# EAGLE design mapleCUx_large_085 (EAGLE 7.3.0)
MAPLE-CUx Large Version
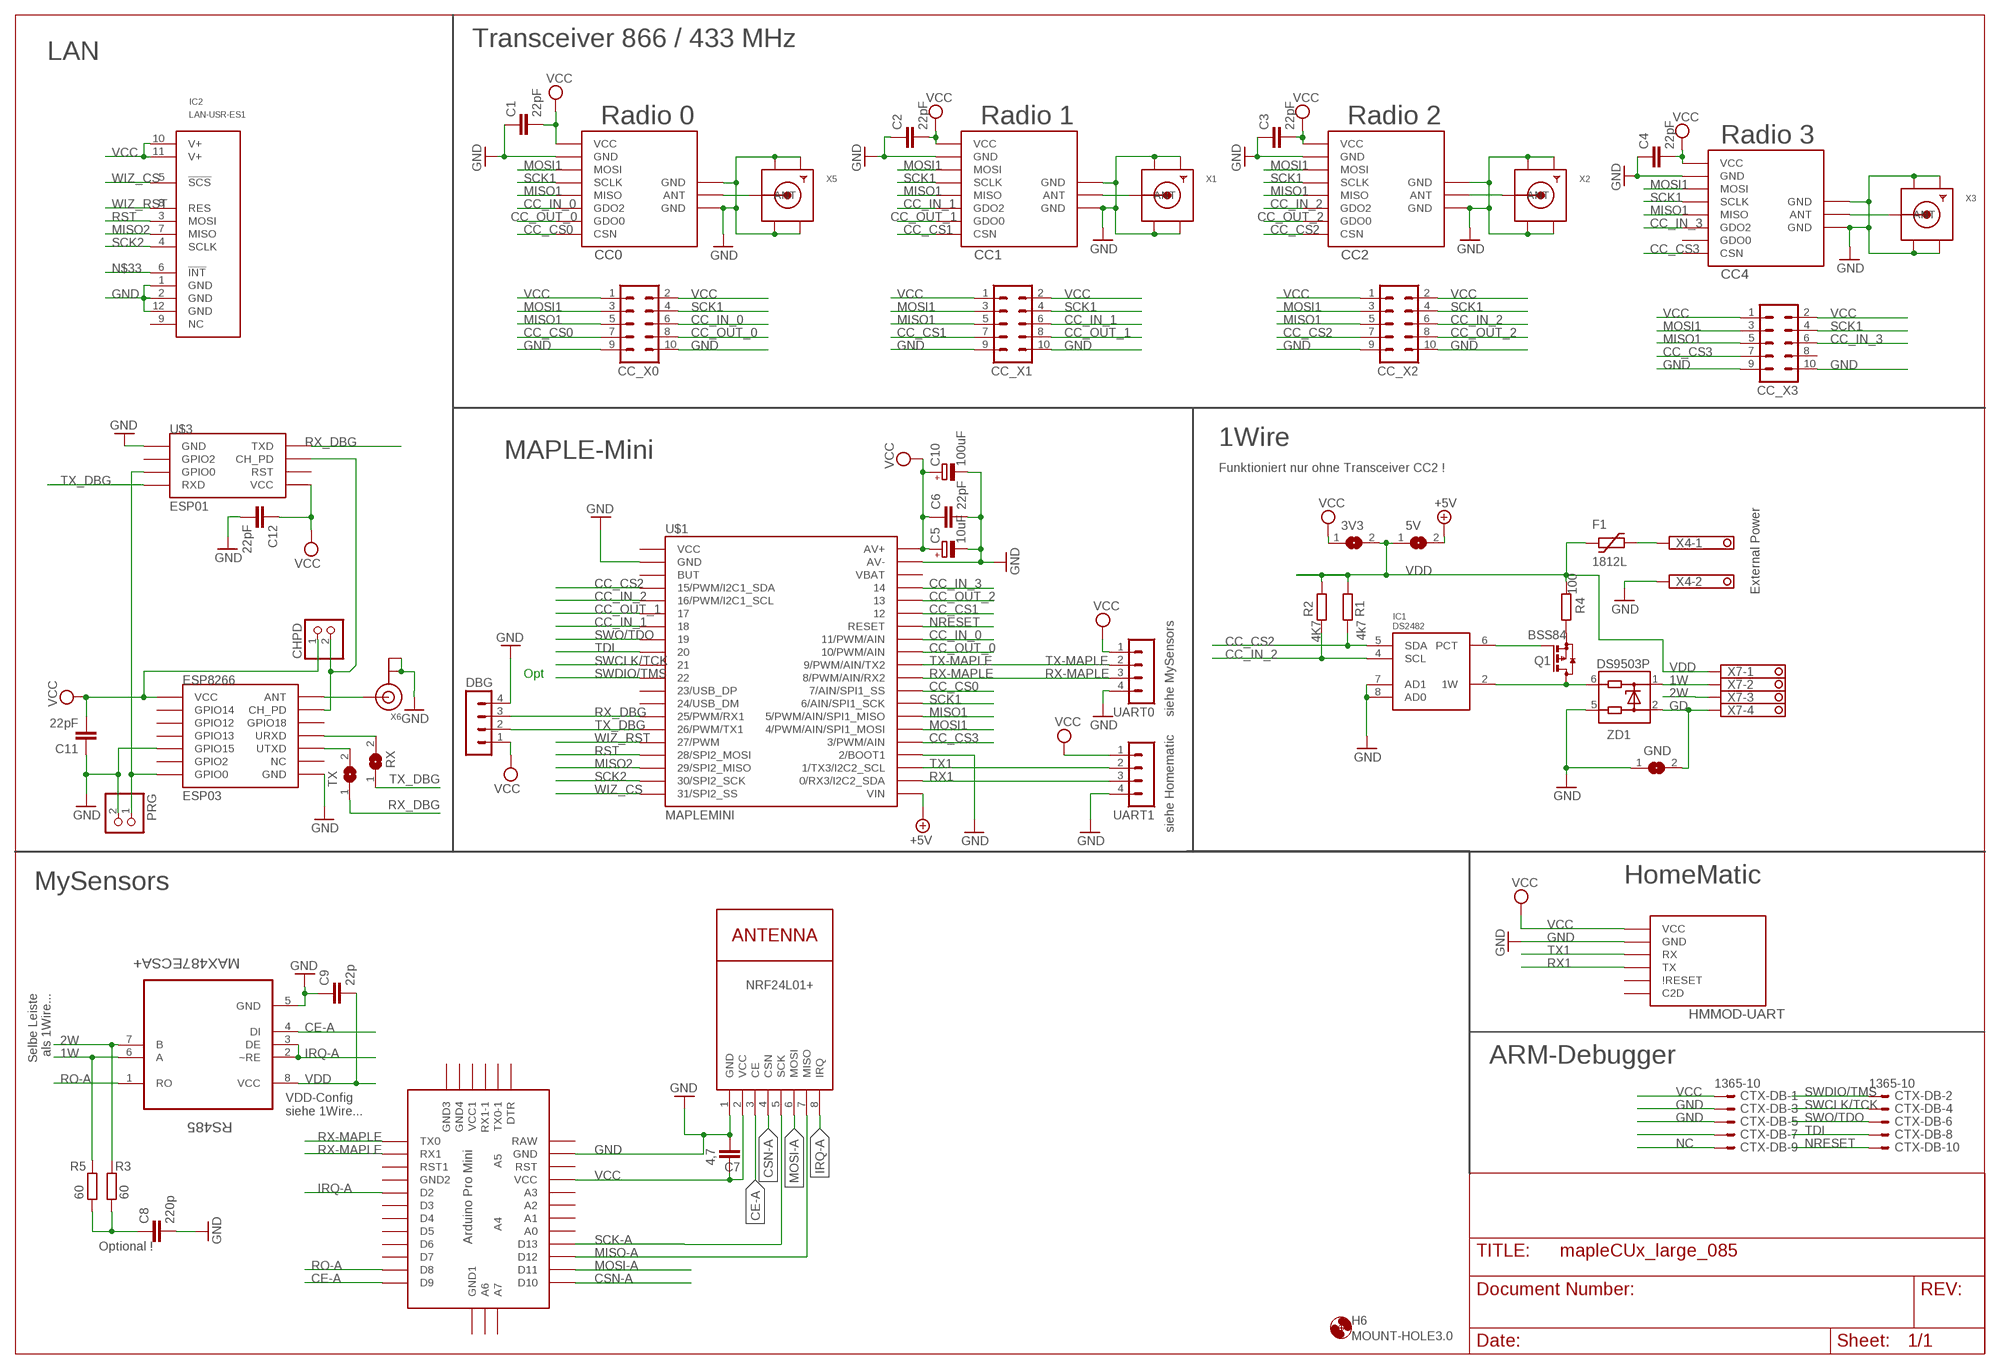
[diagram p0: schematic, sheet 1]

## Parts
3V3  SJ  [SJ]
5V  SJ  [SJ]
C1  22pF  C-EUC0805  [C0805]
C2  22pF  C-EUC0805  [C0805]
C3  22pF  C-EUC0805  [C0805]
C4  22pF  C-EUC0805  [C0805]
C5  10uF  CPOL-EUR/2012-12W  [R/2012-12W]
C6  22pF  C-EUC0805  [C0805]
C7  4,7  C-EUC1210  [C1210]
C8  220p  C-EUC0805  [C0805]
C9  22p  C-EUC0805  [C0805]
C10  100uF  CPOL-EUE5-8.5  [E5-8,5]
C11  22pF  C-EUC0805  [C0805]
C12  22pF  C-EUC0805  [C0805]
CC0  CC1101  CC1101_MODULE1SMD  [CC1101_MODULE1_SMD]
CC1  CC1101_MODULE1SMD  [CC1101_MODULE1_SMD]
CC2  CC1101_MODULE1SMD  [CC1101_MODULE1_SMD]
CC4  CC1101_MODULE1SMD  [CC1101_MODULE1_SMD]
CC_X0  MA05-2  [MA05-2]
CC_X1  MA05-2  [MA05-2]
CC_X2  MA05-2  [MA05-2]
CC_X3  MA05-2  [MA05-2]
CHPD  PINHD-1X2  [1X02]
CTX-DB  1365-10  [1365-10]
DBG  MA04-1  [MA04-1]
ESP8266  ESP03  [ESP03]
F1  1812L  [1812L]
GND  SJ  [SJ]
H6  MOUNT-HOLE3.0  [3,0]
HMMOD-UART  HM-MOD-UARTDIL  [HM-MOD-UART-DIL]
IC1  DS2482  DS2482-100S  [SO08]
IC2  LAN-USR-ES1  [USR-ES1]
NRF24L01+  NRF24L01+  WIRELESS-NRF24L01  [WIRELESS-NRF24L01]
PRG  PINHD-1X2  [1X02]
Q1  BSS84  [SOT23]
R1  4k7  R-EU_R0805  [R0805]
R2  4K7  R-EU_R0805  [R0805]
R3  60  R-EU_R0805  [R0805]
R4  100  R-EU_R0805  [R0805]
R5  60  R-EU_R0805  [R0805]
RS485  MAX487ECSA+  [SOIC127P600X175-8N]
RX  SJ  [SJ]
TX  SJ  [SJ]
U$1  MAPLEMINI  [20-DIP]
U$2  ABK-PRO-MINI  [ABK-PRO-MINI]
U$3  ESP01  [ESP01]
UART0  MA04-1  [MA04-1]
UART1  MA04-1  [MA04-1]
X1  SMACONNECTOR_EDGE_UFL  [SMA_EDGELAUNCH_UFL]
X2  SMACONNECTOR_EDGE_UFL  [SMA_EDGELAUNCH_UFL]
X3  SMACONNECTOR_EDGE_UFL  [SMA_EDGELAUNCH_UFL]
X4  1751248  [1751248]
X5  SMACONNECTOR_EDGE_UFL  [SMA_EDGELAUNCH_UFL]
X6  ANTENNA_U.FL  [U.FL]
X7  1751264  [1751264]
ZD1  DS9503P  [TSOC6]

## Nets
1W: R5.2 RS485.6(A) X7.2 ZD1.1
2W: R3.2 RS485.7(B) X7.3
+5V [PWR]: 5V.2 U$1.21(VIN)
CC_CS0: CC0.CSN CC_X0.7 U$1.29(7/AIN/SPI1_SS)
CC_CS1: CC1.CSN CC_X1.7 U$1.35
CC_CS2: CC2.CSN CC_X2.7 IC1.5(SDA) R1.2 U$1.4(15/PWM/I2C1_SDA)
CC_CS3: CC4.CSN CC_X3.7 U$1.25(3/PWM/AIN)
CC_IN_0: CC0.GDO2 CC_X0.6 U$1.33(11/PWM/AIN)
CC_IN_1: CC1.GDO2 CC_X1.6 U$1.7
CC_IN_2: CC2.GDO2 CC_X2.6 IC1.4(SCL) R2.2 U$1.5(16/PWM/I2C1_SCL)
CC_IN_3: CC4.GDO2 CC_X3.6 U$1.37
CC_OUT_0: CC0.GDO0 CC_X0.8 U$1.32(10/PWM/AIN)
CC_OUT_1: CC1.GDO0 CC_X1.8 U$1.6
CC_OUT_2: CC2.GDO0 CC_X2.8 U$1.36
CE-A: NRF24L01+.3(CE) RS485.4(DI) U$2.D9
CSN-A: NRF24L01+.4(CSN) U$2.D10
GD [PWR]: GND.2 X7.4 ZD1.2
GND [PWR]: C1.1 C2.1 C3.1 C4.1 C5.- C6.2 C7.1 C8.2 C9.1 C10.- C11.1 C12.2 CC0.GND@0(GND) CC0.GND@1(GND) CC0.GND@2(GND) CC1.GND@0(GND) CC1.GND@1(GND) CC1.GND@2(GND) CC2.GND@0(GND) CC2.GND@1(GND) CC2.GND@2(GND) CC4.GND@0(GND) CC4.GND@1(GND) CC4.GND@2(GND) CC_X0.9 CC_X0.10 CC_X1.9 CC_X1.10 CC_X2.9 CC_X2.10 CC_X3.9 CC_X3.10 CTX-DB.3 CTX-DB.5 DBG.4 ESP8266.GND ESP8266.GPIO15 GND.1 HMMOD-UART.2(GND) IC1.7(AD1) IC1.8(AD0) IC2.1(GND) IC2.2(GND) IC2.12(GND) NRF24L01+.1(GND) PRG.2 RS485.5(GND) U$1.2(GND) U$1.24(2/BOOT1) U$1.39(AV-) U$2.GND U$3.GND UART0.4 UART1.4 X1.GND@1(GND1) X1.GND@2(GND2) X1.GND@3(GND3) X1.GND@4(GND4) X2.GND@1(GND1) X2.GND@2(GND2) X2.GND@3(GND3) X2.GND@4(GND4) X3.GND@1(GND1) X3.GND@2(GND2) X3.GND@3(GND3) X3.GND@4(GND4) X4.2 X5.GND@1(GND1) X5.GND@2(GND2) X5.GND@3(GND3) X5.GND@4(GND4) X6.1(GND) X6.2(GND) ZD1.5
IRQ-A: NRF24L01+.8(IRQ) RS485.2(~RE) RS485.3(DE) U$2.D2
MISO1: CC0.MISO CC1.MISO CC2.MISO CC4.MISO CC_X0.5 CC_X1.5 CC_X2.5 CC_X3.5 U$1.27(5/PWM/AIN/SPI1_MISO)
MISO2: IC2.7(MISO) U$1.18(29/SPI2_MISO)
MISO-A: NRF24L01+.7(MISO) U$2.D12
MOSI1: CC0.MOSI CC1.MOSI CC2.MOSI CC4.MOSI CC_X0.3 CC_X1.3 CC_X2.3 CC_X3.3 U$1.26(4/PWM/AIN/SPI1_MOSI)
MOSI-A: NRF24L01+.6(MOSI) U$2.D11
N$1: CC1.ANT X1.P(ANT)
N$2: CC4.ANT X3.P(ANT)
N$3: CC2.ANT X2.P(ANT)
N$4: CC0.ANT X5.P(ANT)
N$8: CTX-DB.7
N$11: ESP8266.GPIO0 PRG.1 U$3.GPIO0
N$12: ESP8266.ANT X6.3(SIGNAL)
N$17: CHPD.2 ESP8266.CH_PD U$3.CH_PD
N$18: ESP8266.URXD RX.2
N$19: ESP8266.UTXD TX.2
N$21: C8.1 R3.1 R5.1
N$33: IC2.6(!INT!)
N$45 [PWR]: F1.P$2 X4.1
N$47: IC1.6(PCT) Q1.1(G)
N$48: IC1.2(1W) Q1.3(D) ZD1.6
N$52: Q1.2(S) R4.1
NC: CTX-DB.9
NRESET: CTX-DB.10 U$1.34(RESET)
RO-A: RS485.1(RO) U$2.D8
RST: IC2.3(MOSI) U$1.17(28/SPI2_MOSI)
RX1: HMMOD-UART.5(TX) U$1.22(0/RX3/I2C2_SDA) UART1.3
RX-MAPLE: U$1.30(8/PWM/AIN/RX2) U$2.RX1 U$2.TX0 UART0.3
RX_DBG: DBG.3 TX.1 U$1.14(25/PWM/RX1) U$3.TX(TXD)
SCK1: CC0.SCLK CC1.SCLK CC2.SCLK CC4.SCLK CC_X0.4 CC_X1.4 CC_X2.4 CC_X3.4 U$1.28(6/AIN/SPI1_SCK)
SCK2: IC2.4(SCLK) U$1.19(30/SPI2_SCK)
SCK-A: NRF24L01+.5(SCK) U$2.D13
SWCLK/TCK: CTX-DB.4 U$1.10
SWDIO/TMS: CTX-DB.2 U$1.11
SWO/TDO: CTX-DB.6 U$1.8
TDI: CTX-DB.8 U$1.9
TX1: HMMOD-UART.6(RX) U$1.23(1/TX3/I2C2_SCL) UART1.2
TX-MAPLE: U$1.31(9/PWM/AIN/TX2) UART0.2
TX_DBG: DBG.2 RX.1 U$1.15(26/PWM/TX1) U$3.RX(RXD)
VCC [PWR]: 3V3.1 C1.2 C2.2 C3.2 C4.2 C5.+ C6.1 C7.2 C10.+ C11.2 C12.1 CC0.VCC CC1.VCC CC2.VCC CC4.VCC CC_X0.1 CC_X0.2 CC_X1.1 CC_X1.2 CC_X2.1 CC_X2.2 CC_X3.1 CC_X3.2 CHPD.1 CTX-DB.1 DBG.1 ESP8266.VCC HMMOD-UART.1(VCC) IC2.10(V+) IC2.11(V+) NRF24L01+.2(VCC) U$1.40(AV+) U$2.VCC U$3.VCC UART0.1 UART1.1
VDD [PWR]: 3V3.2 5V.1 C9.2 F1.P$1 R1.1 R2.1 R4.2 RS485.8(VCC) X7.1
WIZ_CS: IC2.5(!SCS!) U$1.20(31/SPI2_SS)
WIZ_RST: IC2.8(RES) U$1.16(27/PWM)
Unconnected: CC4.GDO0 CC_X3.8 ESP8266.GPIO2 ESP8266.GPIO12 ESP8266.GPIO13 ESP8266.GPIO14 ESP8266.GPIO18 ESP8266.NC HMMOD-UART.3(C2D) HMMOD-UART.4(\!RESET) IC2.9(NC) U$1.1(VCC) U$1.3(BUT) U$1.12(23/USB_DP) U$1.13(24/USB_DM) U$1.38(VBAT) U$2.A0 U$2.A1 U$2.A2 U$2.A3 U$2.A4 U$2.A5 U$2.A6 U$2.A7 U$2.D3 U$2.D4 U$2.D5 U$2.D6 U$2.D7 U$2.DTR U$2.GND1(GND2) U$2.GND2(GND3) U$2.GND3(GND4) U$2.GND4(GND1) U$2.RAW U$2.RST U$2.RST1 U$2.RX1-1 U$2.TX0-1 U$2.VCC1 U$3.GPIO2 U$3.RST

## Notes on the sheet
- Transceiver 866 / 433 MHz
- LAN
- Radio 0 | Radio 1 | Radio 2
- Radio 3
- 1Wire
- MAPLE-Mini
- Funktioniert nur ohne Transceiver CC2 !
- External Power
- Opt
- siehe MySensors
- siehe Homematic
- MySensors | HomeMatic
- Selbe Leiste
  als 1Wire...
- ARM-Debugger
- VDD-Config
  siehe 1Wire...
- Optional !

## Power pins joined to a net without a drawn wire
GND: IC1.3(GND)
VDD: IC1.1(VDD)

## Library data of the parts
3V3 5V GND RX TX = jumper:SJ: SMD solder JUMPER
C1-C4 C6-C9 C11 C12 = rcl:C-EU: CAPACITOR, European symbol
C5 C10 = rcl:CPOL-EU: POLARIZED CAPACITOR, European symbol
CC0 CC1 CC2 CC4 = wireless:CC1101_MODULE1: CC1101 wireless module for 433/868 MHz (sold from Aliexpress). DIL version for mounting with pin header (and SMD soldering) and SMD only variant available.
CC_X0 CC_X1-CC_X3 = con-lstb:MA05-2: PIN HEADER; OC_FARNELL: unknown; OC_NEWARK: unknown
CHPD PRG = pinhead:PINHD-1X2: PIN HEADER
CTX-DB = con-leotronics:1365-10: DUAL ROW STRAIGHT HEADER 1364 SERIES. 1.27mm x 1.27mm. Without Fixing Post. SMT Source: http://www.leotronics.co.uk/Conexcon/Data%20Sheets/sec.%20A/1364ing.pdf; OC_FARNELL: unknown; OC_NEWARK: unknown
DBG UART0 UART1 = con-lstb:MA04-1: PIN HEADER; OC_FARNELL: unknown; OC_NEWARK: unknown
ESP8266 = esp8266modules:ESP03: ESP8266 Wifi module 03; DIMENSIONS: 17.3 x 12.1 mm; PINS: 14; PITCH: 0.078" / 2 mm
F1 = ptc-littlefuse:1812L
H6 = holes:MOUNT-HOLE: MOUNTING HOLE with drill center marker
HMMOD-UART = wireless:HM-MOD-UART: eQ3 HM-MOD-UART-AW-SH2 wireless module for 868 MHz. DIL version for mounting with pin header (antenna upwards) and SMD variant available (antenna downwards).
IC1 = 1wire:DS2482-100: I2C to 1-Wire Host Adapter/Line Driver This device is a onewire host and I2C interface in one chip. It provides the complete DC/AC requirements for onewire communication, including overdrive speed mode, but, unlike the DS2480B chip, no 12V EPROM programming. Notes: For overdrive speed and 5V EEPROM programming, an external active pullup circuit must be connected to the 1W, VDD and PCT pin. See the datasheet for details. The lower two I2C adress bits of the chip can be selected by external pins, so up to 4 chips may be connected to the same I2C bus. Author: Orginal device and description from Giovanni Varasano <giovanni.varasano@fastwebnet.it> Improved by Jan Kandziora <jjj@gmx.de>
IC2 = Martin-Communication:LAN-USR-ES1
NRF24L01+ = diy-modules:WIRELESS-NRF24L01: 2.4 GHz Wireless Module based on NRF24L01 chip
Q1 = transistor-small-signal:BSS84: P-CHANNEL MOS FET
R1-R5 = rcl:R-EU_: RESISTOR, European symbol
RS485 = Maxim_By_element14_Batch_1:MAX487ECSA+: Low-Power, Slew-Rate-Limited RS-485/RS-422 Transceivers; MPN: MAX487ECSA+; OC_FARNELL: 9724532; OC_NEWARK: 68K4803; PACKAGE: SOIC-8; SUPPLIER: Maxim
U$1 = maplemini-small:MAPLEMINI
U$2 = Arduino-clone:ABK-PRO-MINI: ABK Pro-Mini Arduino Clone
U$3 = esp8266modules:ESP01: ESP8266 Wifi module 01
X1-X3 X5 = adafruit:SMACONNECTOR: SMA Connector 90° DIP SMA Connector, 50 Ohm (4UConnector: 07259)
X4 = con-phoenix-350:1751248: MKDS 1/ 2-3,5 Printklemme Nennstrom: 10 A Bemessungsspannung: 160 V Raster: 3,5 mm Polzahl: 2 Montageart: Löten Anschlussart: Schraubanschluss Anschlussrichtung vom Leiter zur Platine: 0° Source: http://eshop.phoenixcontact.com .. 1751248.pdf; OC_FARNELL: unknown; OC_NEWARK: unknown
X6 = adafruit:ANTENNA_U.FL: U.FL Antenna Connector
X7 = con-phoenix-350:1751264: MKDS 1/ 4-3,5 Printklemme Nennstrom: 10 A Bemessungsspannung: 160 V Raster: 3,5 mm Polzahl: 4 Montageart: Löten Anschlussart: Schraubanschluss Anschlussrichtung vom Leiter zur Platine: 0° Source: http://eshop.phoenixcontact.com .. 1751264.pdf; MPN: 1751264; OC_FARNELL: unknown; OC_NEWARK: 10R0934
ZD1 = 1wire:DS9503: ESD Protection Diode with Resistors This ESD protection diode is designed especially for onewire host interfaces. Unlike the DS9502, it has two additional 5Ohm resitors in the 1W and GND line. Pin 5 and 6 have to be connected to the host side, pin 1 und 2 to the network side. The 1W line is through pin 1 and 6, the GND line is through pin 2 and 5. Author: Jan Kandziora <jjj@gmx.de>

## Net classes
0 default: width 0.305 mm
1 PWR: width 0.457 mm

## Board
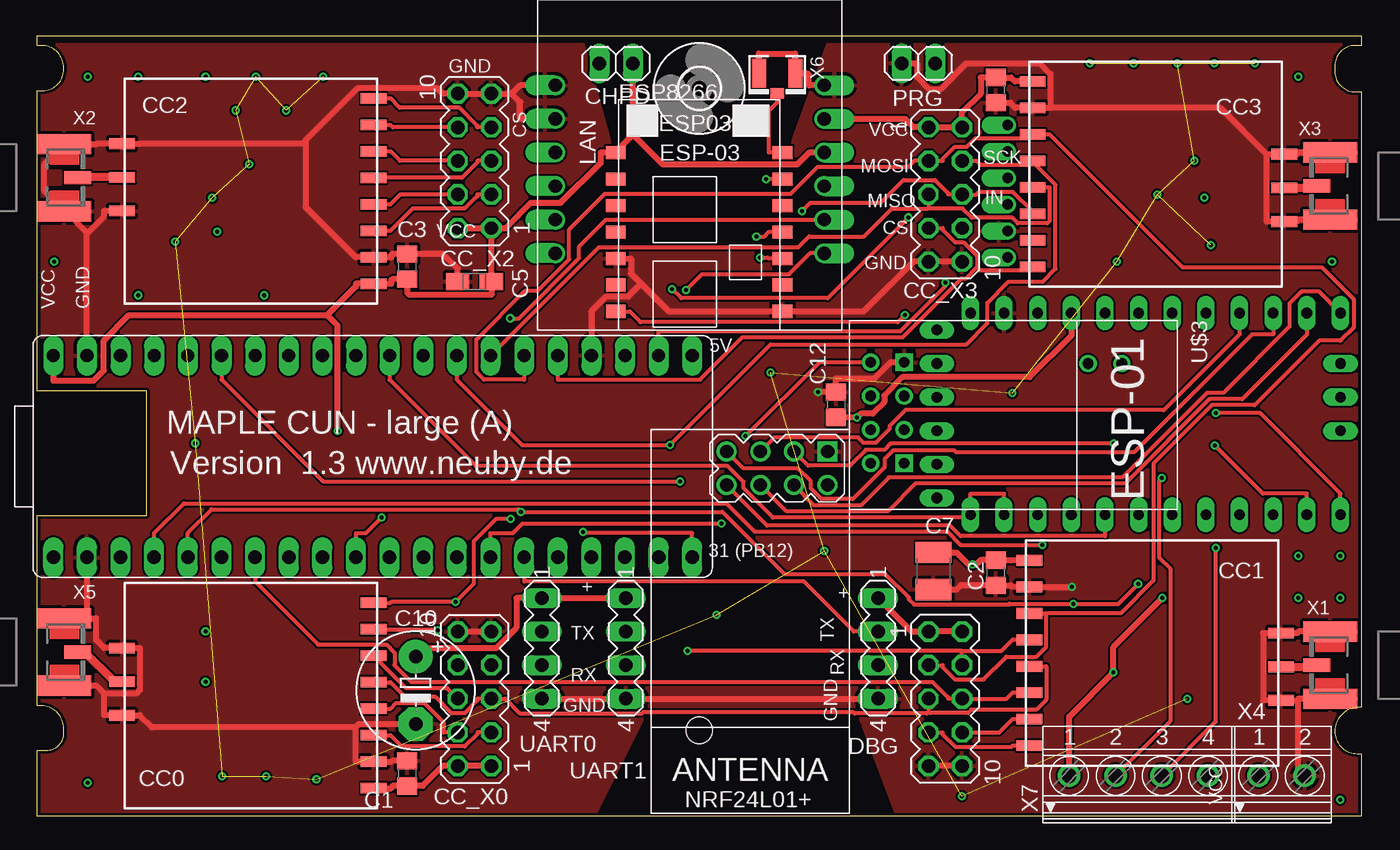
[diagram p1: board, top side]
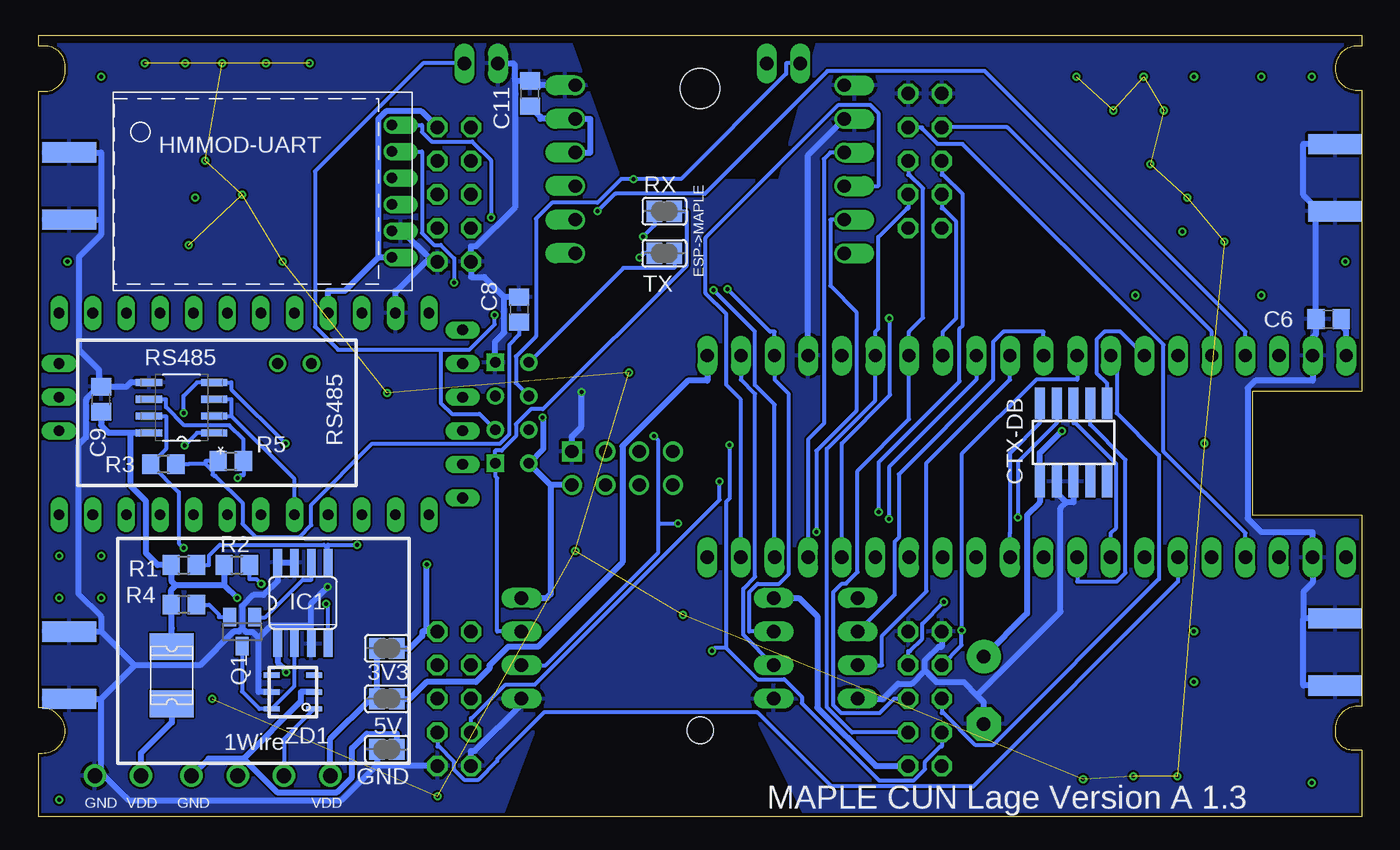
[diagram p2: board, bottom side, seen from below]

Size 100 x 59 mm. Coordinates in mm from the lower left corner, seen from the top.
Outline: 0,0 0,5 0.71,5 arc90 2,6.29 2,6.67 arc90 0.32,8.35 0,8.35 0,22.73 8.26,22.73 8.26,32.13 0,32.13 0,54.83 0.39,54.83 arc90 2,56.44 2,56.57 arc90 0.33,58.24 0,58.24 0,59 100,59 100,58.24 99.54,58.24 arc90 98,56.7 98,56.41 arc90 99.41,54.75 100,54.75 100,8.24 99.8,8.24 arc90 98,6.44 arc90 99.69,4.75 100,4.75 100,0 0,0
Copper layers (1*16): Top 0.035mm / dielectric 1.5mm / Bottom 0.035mm
Design rules "SeeedStudio_2layer_DRU_no_angle_20140221": minimum track width 6mil, minimum drill 12mil, track to track 6mil, track to pad 6mil, pad to pad 6mil, via to via 6mil, smd to smd 0mil, copper to edge 10mil, drill to drill 10mil, minimum pad ring 10mil, minimum via ring 6mil, stop-mask expansion 2mil, vias tented up to drill 100mil, thermal gap 10mil
Holes 2 mm at 50,6.5
tRestrict: area 0,58.6 to 100,59; area 45.7,0 to 62.2,7
bRestrict: area 0,58.6 to 100,59; area 0,58.6 to 100,59; area 45.7,0 to 62.2,7

### Footprints (pad centres in the part's own frame; a part is rotated, then mirrored left to right if it is on the bottom)
SJ = smd 1.168 x 1.6: 1 -0.762,0; 2 0.762,0
C0805 = smd 1.3 x 1.5: 1 -0.95,0; 2 0.95,0
R/2012-12W = smd 1.75 x 1.26: + 1.275,0; - -1.275,0
C1210 = smd 1.6 x 2.7: 1 -1.4,0; 2 1.4,0
E5-8,5 = drill 1.016 pad 2.54: + -2.54,0 | drill 1.016 pad 2.54 octagon: - 2.54,0
CC1101_MODULE1_SMD = smd 1.93 x 0.813: ANT 19,5.96; CSN 0,0; GDO0 0,2; GDO2 0,4; GND@0 0,12; GND@1 19,8.5; GND@2 19,3.42; MISO 0,6; MOSI 0,10; SCLK 0,8; VCC 0,14
MA05-2 = drill 1.016 octagon: 1 -5.08,-1.27; 2 -5.08,1.27; 3 -2.54,-1.27; 4 -2.54,1.27; 5 0,-1.27; 6 0,1.27; 7 2.54,-1.27; 8 2.54,1.27; 9 5.08,-1.27; 10 5.08,1.27
1X02 = drill 1.016 long: 1 -1.27,0; 2 1.27,0
1365-10 = smd 0.76 x 2.4: 1 -2.54,-2.95; 2 -2.54,2.95; 3 -1.27,-2.95; 4 -1.27,2.95; 5 0,-2.95; 6 0,2.95; 7 1.27,-2.95; 8 1.27,2.95; 9 2.54,-2.95; 10 2.54,2.95
MA04-1 = drill 1.016 long: 1 -3.81,0; 2 -1.27,0; 3 1.27,0; 4 3.81,0
ESP03 = smd 1.5 x 1: ANT 7.4,4.8; CH_PD 7.4,2.8; GND 7.4,-7.2; GPIO0 -5.2,-7.2; GPIO2 -5.2,-5.2; GPIO12 -5.2,0.8; GPIO13 -5.2,-1.2; GPIO14 -5.2,2.8; GPIO15 -5.2,-3.2; GPIO18 7.4,0.8; NC 7.4,-5.2; URXD 7.4,-1.2; UTXD 7.4,-3.2; VCC -5.2,4.8
1812L = smd 2.03 x 3.3: P$1 -2.16,0; P$2 2.16,0
3,0 = hole 3: 0,0
HM-MOD-UART-DIL = drill 0.8 offset: 1 0,12; 2 0,10; 3 0,8; 4 0,6; 5 0,4; 6 0,2
SO08 = smd 0.66 x 2.032: 1 -1.905,-3.073; 2 -0.635,-3.073; 3 0.635,-3.073; 4 1.905,-3.073; 5 1.905,3.073; 6 0.635,3.073; 7 -0.635,3.073; 8 -1.905,3.073
USR-ES1 = drill 1 pad 1.35 offset: 1 -10.16,5.715; 2 -10.16,3.175; 3 -10.16,0.635; 4 -10.16,-1.905; 5 -10.16,-4.445; 6 -10.16,-6.985; 7 10.16,-6.985; 8 10.16,-4.445; 9 10.16,-1.905; 10 10.16,0.635; 11 10.16,3.175; 12 10.16,5.715
WIRELESS-NRF24L01 = drill 1 square: 1 -12.7,6.35 | drill 1: 2 -10.16,6.35; 3 -12.7,3.81; 4 -10.16,3.81; 5 -12.7,1.27; 6 -10.16,1.27; 7 -12.7,-1.27; 8 -10.16,-1.27
SOT23 = smd 1 x 1.4: 1 -0.95,-1.1; 2 0.95,-1.1; 3 0,1.1
R0805 = smd 1.3 x 1.5: 1 -0.95,0; 2 0.95,0
SOIC127P600X175-8N = smd 1.981 x 0.533: 1 -2.464,1.905; 2 -2.464,0.635; 3 -2.464,-0.635; 4 -2.464,-1.905; 5 2.464,-1.905; 6 2.464,-0.635; 7 2.464,0.635; 8 2.464,1.905
20-DIP = drill 1.016 pad 1.27 long: 1 -24.13,-7.62; 2 -21.59,-7.62; 3 -19.05,-7.62; 4 -16.51,-7.62; 5 -13.97,-7.62; 6 -11.43,-7.62; 7 -8.89,-7.62; 8 -6.35,-7.62; 9 -3.81,-7.62; 10 -1.27,-7.62; 11 1.27,-7.62; 12 3.81,-7.62; 13 6.35,-7.62; 14 8.89,-7.62; 15 11.43,-7.62; 16 13.97,-7.62; 17 16.51,-7.62; 18 19.05,-7.62; 19 21.59,-7.62; 20 24.13,-7.62 | drill 1 pad 1.27 long: 21 24.13,7.62; 22 21.59,7.62; 23 19.05,7.62; 24 16.51,7.62; 25 13.97,7.62; 26 11.43,7.62; 27 8.89,7.62; 28 6.35,7.62; 29 3.81,7.62; 30 1.27,7.62; 31 -1.27,7.62; 32 -3.81,7.62; 33 -6.35,7.62; 34 -8.89,7.62; 35 -11.43,7.62; 36 -13.97,7.62; 37 -16.51,7.62; 38 -19.05,7.62; 39 -21.59,7.62; 40 -24.13,7.62
ABK-PRO-MINI = drill 0.8 long: A0 10.16,-3.81; A1 10.16,-6.35; A2 10.16,-8.89; A3 10.16,-11.43; A6 3.81,-21.59; A7 6.35,-21.59; D2 -5.08,-3.81; D3 -5.08,-6.35; D4 -5.08,-8.89; D5 -5.08,-11.43; D6 -5.08,-13.97; D7 -5.08,-16.51; D8 -5.08,-19.05; D9 -5.08,-21.59; D10 10.16,-21.59; D11 10.16,-19.05; D12 10.16,-16.51; D13 10.16,-13.97; DTR 8.89,8.89; GND 10.16,3.81; GND1 -5.08,-1.27; GND2 -3.81,8.89; GND3 -1.27,8.89; GND4 1.27,-21.59; RAW 10.16,6.35; RST 10.16,1.27; RST1 -5.08,1.27; RX1 -5.08,3.81; RX1-1 3.81,8.89; TX0 -5.08,6.35; TX0-1 6.35,8.89; VCC 10.16,-1.27; VCC1 1.27,8.89 | drill 0.8: A4 6.35,-5.08; A5 6.35,-2.54
ESP01 = drill 0.8: CH_PD -1.285,-8.178; GPIO0 1.255,-5.638; GPIO2 -1.285,-5.638; RST 1.255,-8.178; TX -3.825,-8.178; VCC 3.795,-8.178 | drill 0.8 square: GND -3.825,-5.638; RX 3.795,-5.638
SMA_EDGELAUNCH_UFL = smd 4.064 x 1.524: GND@1 2.032,-2.54; GND@2 2.032,2.54 | smd 4.064 x 1.524 bottom: GND@3 2.032,2.54; GND@4 2.032,-2.54 | smd 2.032 x 1.016: P 3.048,0
1751248 = drill 1.1 pad 1.7: 1 -1.75,-0.1; 2 1.75,-0.1
U.FL = smd 2.2 x 1.05: 1 0,1.375; 2 0,-1.375 | smd 0.8 x 1: 3 1.525,0
1751264 = drill 1.1 pad 1.7: 1 -5.25,-0.1; 2 -1.75,-0.1; 3 1.75,-0.1; 4 5.25,-0.1
TSOC6 = smd 0.406 x 1.219: 1 -1.27,-1.6; 2 0,-1.6; 3 1.27,-1.6; 4 1.27,1.6; 5 0,1.6; 6 -1.27,1.6

### Placement (x,y rotation side)
3V3  73.66,12.7 180 bottom
5V  73.66,8.89 0 bottom
C1  27.94,3.25 270 top
C2  72.39,18.41 90 top
C3  27.94,41.55 270 top
C4  72.39,54.88 90 top
C5  33.02,40.4 0 top
C6  2.54,37.58 180 bottom
C7  67.69,18.54 90 top
C8  63.67,38.3 90 bottom
C9  95.25,31.52 270 bottom
C10  28.57,9.53 270 top
C11  62.87,54.61 270 bottom
C12  60.33,31.11 90 top
CC0  25.4,16.14 180 top
CC1  74.93,5.35 0 top
CC2  25.4,54.24 180 top
CC4  75.18,41.53 0 top
CC_X0  33.02,8.89 90 top
CC_X1  68.58,8.89 270 top
CC_X2  33.02,49.53 90 top
CC_X3  68.58,46.99 270 top
CHPD  43.72,56.9 180 top
CTX-DB  21.81,28.26 0 bottom
DBG  63.5,12.7 270 top
ESP8266  48.9,45.35 0 top
F1  89.92,10.67 270 bottom
GND  73.66,5.08 0 bottom
H6  50,55 0 top
HMMOD-UART  73.28,54.23 180 bottom
IC1  80.01,16.13 0 bottom
IC2  49.28,49.53 0 top
NRF24L01+  53.34,14.88 270 top
PRG  66.55,56.9 180 top
Q1  84.6,13.95 180 bottom
R1  89,19 0 bottom
R2  85,19 0 bottom
R3  90.55,26.61 180 bottom
R4  89,16 180 bottom
R5  85.45,26.84 0 bottom
RS485  89.17,30.89 180 bottom
RX  52.7,45.72 180 bottom
TX  52.7,42.55 180 bottom
U$1  25.34,27.19 0 top
U$2  76.83,27.87 90 top
U$3  71.12,30.48 270 top
UART0  38.1,12.7 270 top
UART1  44.45,12.7 270 top
X1  99.69,11.43 180 top
X2  0,48.26 0 top
X3  99.69,47.62 180 top
X4  93.98,3.17 0 top
X5  0,12.43 0 top
X6  55.88,56.15 270 top
X7  83.19,3.17 0 top
ZD1  80.77,9.4 90 bottom

### Tracks (layer width: path | path; a pad name or v marks a point on that pad's centre or on a via)
1W  (via drill 0.3 pad 0.61)
  Top 0.305: X7.2 85.6,7.24 85.6,18.69 84.77,19.52 84.77,25.4 v84.93,25.57
  Bottom 0.305: RS485.6 90.34,31.52 90.34,30.92 88.97,29.55 85.56,29.55 84.5,28.49 R5.2 84.5,25.79 84.71,25.79 v84.93,25.57 | ZD1.1 81.44,5.87 X7.2
2W  (via drill 0.3 pad 0.61)
  Top 0.305: X7.3 89.03,7.17 v89.03,20.29
  Bottom 0.305: v89.03,20.29 89.37,20.63 89.37,24.49 R3.2 90.34,27.78 90.34,30.25 RS485.7
+5V
  Bottom 0.457: 5V.2 71.93,8.89 70.66,10.16 66.93,10.16 65.91,11.18 65.91,11.41 64.5,12.83 62.26,12.83 55.88,19.21 55.88,27.97 50.93,32.92 49.47,32.92 U$1.21
CC_CS0  (via drill 0.3 pad 0.61)
  Top 0.305: CC0.CSN 26.67,16.14 26.72,16.2 v31.58,16.2 32.96,17.57 32.96,20.79 34.63,22.47 v35.75,22.47
  Bottom 0.305: v35.75,22.47 35.75,26.4 29.15,33 U$1.29 | CC_X0.7 34.29,12.5 34.16,12.5 33.22,13.43 33.22,14.55 v31.58,16.2
CC_CS1  (via drill 0.3 pad 0.61)
  Top 0.305: CC1.CSN 73.66,5.35 73.55,5.24 69.35,5.24 68.38,6.22 68.38,6.35 CC_X1.7 | U$1.35 13.91,33 21.6,25.31 v48.54,25.31
  Bottom 0.305: CC_X1.7 67.31,7.42 67.25,7.42 64.69,9.98 62.47,9.98 48.54,23.91 v48.54,25.31
CC_CS2  (via drill 0.3 pad 0.61)
  Top 0.305: U$1.4 8.83,21.4 11.09,23.66 52.05,23.66 54.19,21.52 68.73,21.52 69.74,20.52 v75.91,20.52 | CC2.CSN 26.67,54.24 27.38,53.53 31.89,53.53 33.22,52.2 33.22,52.07 CC_X2.7
  Bottom 0.305: R1.2 87.09,19 87.09,19.72 86.29,20.52 78.42,20.52 78.11,20.21 | 78.11,20.21 78.11,20.52 v75.91,20.52 | IC1.5 78.11,20.21 | CC_X2.7 33.22,52.07 33.22,51.96 32.06,50.8 30.18,50.8 15.02,35.63 15.02,27.59 8.83,21.4 U$1.4
CC_CS3
  Top 0.305: U$1.25 39.31,33 50.07,33 53.28,36.21 65.36,36.21 69.81,40.65 70.13,40.65 70.97,41.49 | CC_X3.7 68.38,44.45 68.38,44.32 69.31,43.38 69.95,43.38 70.97,42.37 70.97,41.49 | 70.97,41.49 71.19,41.27 74.92,41.27 CC4.CSN
CC_IN_0
  Top 0.305: CC_X0.6 30.95,9.69 27.86,9.69 CC0.GDO2
  Bottom 0.305: CC_X0.6 31.75,7.82 31.64,7.82 29.2,5.38 27.9,5.38 15.35,17.94 15.35,27.28 18.55,30.48 18.55,34.38 U$1.33
CC_IN_1
  Top 0.305: CC1.GDO2 73.66,9.35 73.2,8.89 CC_X1.6 68.78,8.89 68.78,9 67.62,10.16 28.25,10.16 26.97,11.43 26.97,12.38 26.37,12.98 21.21,12.98 16.45,17.75 U$1.7
CC_IN_2  (via drill 0.3 pad 0.61)
  Top 0.305: U$1.5 11.37,21.4 13.16,23.2 36.34,23.2 v36.52,23.02 51.74,23.02 56.42,18.33 64.04,18.33 65.83,16.54 65.83,16.41 66.24,16 73.39,16 73.44,16.06 v78.25,16.06 81.64,16.06 v83.14,17.57 | CC2.GDO2 26.67,50.24 27.39,49.53 CC_X2.6
  Bottom 0.305: v36.52,23.02 36.52,26.77 30.42,32.88 30.42,36.86 30.18,37.1 30.18,47 31.64,48.46 31.75,48.46 CC_X2.6 | R2.2 84.05,17.95 83.52,17.95 v83.14,17.57 | IC1.4 78.11,15.92 v78.25,16.06
CC_IN_3  (via drill 0.3 pad 0.61)
  Top 0.305: CC4.GDO2 75.18,45.68 73.67,47.2 71.13,47.2 70.92,46.99 CC_X3.6 68.78,46.99 68.78,47.1 67.81,48.07 65.43,48.07 63.72,46.35 58.39,46.35 v57.76,45.72
  Bottom 0.305: U$1.37 8.83,36.63 28.5,56.3 40.4,56.3 49.66,47.05 56.43,47.05 v57.76,45.72
CC_OUT_0  (via drill 0.3 pad 0.61)
  Top 0.305: CC0.GDO0 30.18,14.14 v30.25,14.07
  Bottom 0.305: U$1.32 21.53,33 24.62,33 30.25,27.37 v30.25,14.07 30.25,12.93 CC_X0.8
CC_OUT_1
  Top 0.305: CC1.GDO0 73.66,7.35 72.66,6.35 CC_X1.8
  Bottom 0.305: CC_X1.8 69.85,5.28 69.74,5.28 68.58,4.12 68.58,3.53 67.79,2.74 66.79,2.74 65.33,4.19 65.33,4.33 61.8,7.86 45.69,7.86 40.1,2.27 29.38,2.27 13.91,17.75 U$1.6
CC_OUT_2
  Top 0.305: CC2.GDO0 26.67,52.24 26.84,52.07 CC_X2.8
  Bottom 0.305: U$1.36 11.37,36.63 26.81,52.07 CC_X2.8
CE-A  (via drill 0.3 pad 0.61)
  Top 0.305: v81.31,28.16 64.44,28.16 63.98,27.7 62.58,27.7 61.4,26.52 58.21,26.52 NRF24L01+.3 | U$2.D9 98.42,24.4 92.36,30.47 v89.02,30.47
  Bottom 0.305: v81.31,28.16 85.41,32.27 85.41,32.79 RS485.4 87.35,32.79 88,32.79 89.02,31.77 v89.02,30.47
CSN-A
  Top 0.305: U$2.D10 96.81,39.64 95.47,39.64 94.58,38.75 94.58,37 89.57,31.99 88.35,31.99 81.97,25.61 64.31,25.61 62.2,23.51 58.67,23.51 NRF24L01+.4
GD
  Bottom 0.457: 84.48,4.37 81.95,1.84 77.42,1.84 76.29,2.97 76.29,5.15 75.19,6.26 72.9,6.26 GND.2 | 84.48,4.37 80.16,8.69 80.16,9.4 ZD1.2 | 84.48,4.37 87.14,4.37 X7.4
GND  (via drill 0.3 pad 0.61)
  Top 0.457: 3.75,44.11 2.13,45.72 | U$1.39 3.75,44.11 | 3.75,44.11 3.83,44.11 5.05,45.33 5.05,45.74 CC2.GND@1 | X3.GND@1 95.25,50.16 95.11,50.03 CC4.GND@1 92.84,50.03 | X3.GND@2 95.25,45.09 95.11,44.95 CC4.GND@2 92.84,44.95 92.84,50.03 | X4.2 95.25,3.56 95.25,8.77 | 95.25,8.77 CC1.GND@2 92.58,8.77 92.58,13.85 CC1.GND@1 95.13,13.85 95.25,13.97 X1.GND@1 | 95.25,8.77 95.25,8.89 X1.GND@2 | IC2.2 36.47,52.7 36.47,53.98 35.84,54.61 | 35.84,54.61 36.47,55.24 IC2.1 | 35.84,54.61 CC_X2.9 CC_X2.10 30.61,54.61 30.18,55.03 24.2,55.03 20.26,51.09 20.26,50.83 | 20.26,50.83 20.26,46.04 24.05,42.24 CC2.GND@0 26.75,42.24 26.75,42.43 26.81,42.49 C3.1 30.66,42.49 31.75,41.41 C5.- | 20.26,50.83 7.75,50.83 CC2.GND@2 4.47,50.83 4.45,50.8 X2.GND@2 0.53,49.3 0.53,47.24 2.05,45.72 2.13,45.72 | X2.GND@4 2.13,45.72 | 5.05,9.28 4.45,9.89 X5.GND@1 | 5.05,9.28 5.05,7.64 CC0.GND@1 7.75,7.64 8.67,6.72 24.05,6.72 | 5.05,9.28 7.47,9.28 7.75,9.56 7.75,12.72 CC0.GND@2 5.88,12.72 5.05,12.72 4.45,13.33 4.45,14.97 3.75,14.97 | v58.97,32.06 C12.2 60.33,33.1 63.24,33.1 64.45,34.3 U$3.GND | C7.1 69.42,17.14 69.75,17.46 C2.1 73.52,17.46 73.58,17.4 73.58,17.35 CC1.GND@0 v78.13,17.35 | C1.1 26.81,4.21 26.75,4.14 CC0.GND@0 24.05,4.14 24.05,6.72 | 24.05,6.72 24.32,6.99 C10.- | X5.GND@2 3.75,14.97 | U$1.2 3.75,14.97 | IC2.12 58.3,55.24 58.3,56.01 58.16,56.15 X6.1 57.26,57.63 54.51,57.63 X6.2 | PRG.2 66.42,56.9 66.42,55.88 67.35,54.96 68.26,54.96 70.19,56.89 75.73,56.89 76.53,56.09 76.53,53.53 | C4.1 73.52,53.93 73.52,53.85 73.84,53.53 CC4.GND@0 76.53,53.53 | 45.6,40.25 44.62,39.27 42.96,39.27 41.85,38.16 U$1.24 | 45.6,40.25 47.7,38.16 ESP8266.GND 62.41,38.16 66.17,41.91 CC_X3.9 CC_X3.10
  Top 0.457: 45.6,40.25 44.83,41.02 44.83,42.16 ESP8266.GPIO15 | CC_X0.10 CC_X0.9 | DBG.4 UART1.4 UART0.4 | CC_X1.10 CC_X1.9 | 92.84,50.03 89.34,53.53 76.53,53.53
  Bottom 0.457: CC_X1.10 74.33,3.81 74.42,3.9 | 95.25,3.31 95.25,8.89 | X4.2 95.49,3.08 95.25,3.31 | 95.25,3.31 93.16,1.23 77.09,1.23 74.42,3.9 | GND.1 74.42,3.9 | 64,55.56 64,46.01 66.95,43.05 67.31,43.05 CC_X3.9 67.31,40.77 66.32,40.77 64.8,39.24 | 64,55.56 63.84,55.56 C11.1 62.39,55.56 62.08,55.24 IC2.12 | PRG.2 64.14,56.9 64,56.76 64,55.56 | 92.71,11.43 95.25,13.97 | 84.6,14.22 84.85,13.97 85.24,13.97 87.78,11.43 92.71,11.43 | 92.71,11.43 95.25,8.89 | X1.GND@2 95.25,8.89 | 84.6,14.22 84.6,15.88 83.75,16.73 82.99,16.73 81.92,17.8 IC1.8 IC1.7 | 84.6,14.22 84.31,13.94 83.8,13.94 83.36,13.5 | RS485.5 93,32.79 93.33,32.47 C9.1 95.34,32.47 95.42,32.47 | U$3.GND 65.48,35.89 64.8,36.57 64.8,39.24 | C8.2 64.8,39.24 | X5.GND@1 4.45,9.89 4.45,14.97 | X5.GND@2 4.45,14.97 | 4.45,14.97 4.45,16.97 3.75,17.67 U$1.2 3.75,21.48 7.61,21.48 8.66,22.53 8.66,32.35 8.09,32.92 3.75,32.92 U$1.39 3.75,36.19 3.49,36.45 3.49,37.01 C6.2 3.49,45.47 3.24,45.72 | 95.42,32.47 96.4,31.5 96.4,28.63 96.97,28.06 96.97,16.83 95.25,15.11 95.25,13.97 | 95.25,45.09 95.25,43.94 96.94,42.25 96.94,35.27 95.42,33.76 95.42,32.47 | X1.GND@1 95.25,13.97 | X3.GND@1 95.25,50.16 95.25,45.09 | X3.GND@2 95.25,45.09 | ZD1.5 83.36,9.4 83.36,13.5 | CC_X1.9 67.31,4.95 67.02,4.95 63.5,8.48 DBG.4 | 29.1,9.16 28.57,8.64 C10.- | 33.03,11.02 32.17,10.16 30.1,10.16 29.1,9.16 | 29.1,9.16 22.8,15.46 22.8,23.29 22.36,23.73 | 22.36,23.73 23.08,24.45 23.08,24.74 CTX-DB.3 | 22.36,23.73 21.81,23.73 CTX-DB.5 | 33.03,11.02 33.03,11.78 31.99,12.83 31.75,12.83 CC_X0.10 | 33.03,11.02 34.02,10.03 35.05,10.03 36.2,8.89 UART0.4 | v58.97,32.06 58.97,29.43 59.69,28.71 NRF24L01+.1
  Bottom 0.457: X2.GND@2 4.45,50.8 4.45,46.93 3.24,45.72 | X2.GND@4 3.24,45.72 | U$2.GND 73.03,39.72 72.9,39.72 70.45,42.17 | CC_X3.10 70.19,41.91 70.45,42.17 | 70.45,42.17 72.51,44.23 HMMOD-UART.2 | IC1.3 79.38,14.45 | 83.36,13.5 82.41,14.45 79.38,14.45 | U$1.24 41.85,49.97 IC2.2 | 79.38,14.45 79.38,16.11 v78.13,17.35
  pour Top: 0,0 0,59 41,59 44,48 56,48 60,59 100,59 100,0 65,0 62,8 46,8 42,0
  pour Bottom: 0,0 0,59 41,59 44,48 56,48 60,59 100,59 100,0 65,0 62,8 46,8 42,0
IRQ-A
  Top 0.305: NRF24L01+.8 55.12,21.98 68.92,21.98 69.73,21.18 80.64,21.18 U$2.D2
  Bottom 0.305: 85.41,30.25 RS485.2 85.41,30.25 | RS485.3 85.41,31.52 85.41,30.25 | U$2.D2 80.64,25.48 85.41,30.25
MISO1
  Top 0.305: CC_X2.5 33.22,49.53 33.22,49.4 32.07,48.24 CC2.MISO | CC1.MISO 76.2,11.35 76.2,8.82 75.46,8.07 70.54,8.07 70.29,7.82 67.4,7.82 67.31,7.91 | CC0.MISO 26.67,10.14 27.78,9.03 30.07,9.03 31.3,7.81 32.27,7.81 33.22,8.76 33.22,8.89 CC_X0.5 35.36,8.89 36.48,7.77 45.64,7.77 45.76,7.88 61.64,7.88 61.74,7.79 67.18,7.79 67.31,7.91 | CC4.MISO 76.45,47.53 76.45,44.99 76.28,44.82 74.05,44.82 73.64,45.23 70.58,45.23 69.89,45.92 67.31,45.92 | CC_X3.5 67.31,45.92 | U$1.27 42.41,43 57.48,43 58.29,43.81 62.43,43.81 64.54,45.92 67.31,45.92 | CC_X1.5 67.31,7.91
  Bottom 0.305: CC_X2.5 34.29,48.46 34.18,48.46 33.17,47.45 33.17,37.68 34.23,36.63 U$1.27 34.23,30.01 38.12,26.12 38.12,18.47 38.99,17.6 39.29,17.6 39.94,16.95 39.94,8.4 39.34,7.8 36.45,7.8 35.36,8.89 CC_X0.5
MISO2  (via drill 0.3 pad 0.61)
  Top 0.305: IC2.7 58.38,42.55 56.79,40.96 50.19,40.96 v48.99,39.76
  Bottom 0.305: U$1.18 44.39,31.11 45.87,32.59 45.87,36.64 v48.99,39.76
MISO-A
  Top 0.305: U$2.D12 93.34,36.42 91.73,36.42 82.82,27.5 69.41,27.5 69.27,27.65 64.64,27.65 64,27 64,26.37 61.6,23.97 59.25,23.97 58.42,24.8 58.42,25.34 57.45,26.3 53.34,26.3 NRF24L01+.7
MOSI1
  Top 0.305: CC2.MOSI 26.67,44.24 28.35,45.92 32.29,45.92 33.22,46.86 33.22,46.99 CC_X2.3 | CC_X1.3 68.38,11.43 68.38,11.3 69.32,10.36 71.47,10.36 73.18,12.06 75.44,12.06 76.2,12.82 76.2,15.35 | CC0.MOSI 26.67,6.14 27.53,5.28 32.29,5.28 33.22,6.22 33.22,6.35 CC_X0.3 | U$1.26 36.77,33 33.74,33 33.16,33.58 33.16,36.05 36.84,39.73 37.82,39.73 40.17,42.08 40.17,44.34 42.87,47.04 56.91,47.04 58.96,49.09 65.8,49.09 66.24,49.53 CC_X3.3 68.38,49.53 68.38,49.66 69.31,50.6 70.2,50.6 70.84,51.23 74.88,51.23 CC4.MOSI 76.45,51.53 86.49,41.49 97.01,41.49 99.42,39.08 99.42,36.94 98.42,35.95 96.81,35.95 91.94,31.08 88.73,31.08 84.31,26.66 84.31,17.82 81.84,15.35 76.2,15.35 | CC1.MOSI 76.2,15.35
  Bottom 0.305: CC_X2.3 34.29,45.92 34.4,45.92 36.55,43.77 36.55,36.84 36.77,36.63 U$1.26 36.77,31.43 40.43,27.77 40.43,8.25 38.53,6.35 CC_X0.3
MOSI-A
  Top 0.305: NRF24L01+.6 56.59,23.05 64.23,23.05 66.33,25.16 82.16,25.16 88.54,31.53 91,31.53 95.89,36.42 U$2.D11
N$1
  Top 0.61: CC1.ANT 96.53,11.31 X1.P
N$2
  Top 0.61: CC4.ANT 96.51,47.49 X3.P
N$3
  Top 0.61: CC2.ANT 3.05,48.28 X2.P
N$4
  Top 0.61: CC0.ANT 6.1,10.19 6.1,10.16 5.84,10.16 3.56,12.45 3.06,12.45 X5.P
N$6  (via drill 0.3 pad 0.61)
  other vias: 3.81,55.88
N$7  (via drill 0.3 pad 0.61)
  other vias: 1.27,41.91
N$9  (via drill 0.3 pad 0.61)
  other vias: 3.81,2.54
N$11  (via drill 0.3 pad 0.61)
  Top 0.305: v65.52,37.87 65,37.35 45.55,37.35 44.75,38.16 ESP8266.GPIO0
  Bottom 0.305: 69.59,35.26 67.43,35.26 65.52,37.18 v65.52,37.87 | 69.59,35.26 69.59,31.25 68.75,30.41 66.67,30.41 U$3.GPIO0 | PRG.1 70.94,56.9 79.1,48.74 79.1,37 77.36,35.26 69.59,35.26
N$12
  Top 0.305: X6.3 55.88,53.92 55.24,53.28 55.24,50.16 ESP8266.ANT
N$13  (via drill 0.3 pad 0.61)
  other vias: 7.62,55.88
N$14  (via drill 0.3 pad 0.61)
  other vias: 12.7,55.88
N$16  (via drill 0.3 pad 0.61)
  other vias: 95.25,55.88
N$17  (via drill 0.3 pad 0.61)
  Top 0.305: ESP8266.CH_PD 55.24,48.16 55.24,48.15 v55.05,48.15
  Bottom 0.305: CHPD.2 43.52,56.9 43.52,56.1 51.46,48.15 v55.05,48.15 55.97,48.15 57.77,46.35 61.2,46.35 62.4,45.16 62.4,36.27 63.91,34.75 63.91,32.74 U$3.CH_PD
N$18  (via drill 0.3 pad 0.61)
  Top 0.305: ESP8266.URXD 55.24,44.16 54.91,43.82 v54.3,43.82
  Bottom 0.305: RX.2 53.47,44.62 53.51,44.62 v54.3,43.82
N$19  (via drill 0.3 pad 0.61)
  Top 0.305: ESP8266.UTXD 55.24,42.16 55.17,42.22 v54.58,42.22
  Bottom 0.305: TX.2 54.36,42.55 54.36,42.45 v54.58,42.22
N$21
  Bottom 0.305: R5.1 87.36,26.84 87.36,26.62 | 87.36,26.62 86.83,26.09 86.83,25.83 86.74,25.74 86.63,25.74 84.56,23.67 84.56,22.11 83.59,21.14 80.25,21.14 79.38,22.02 79.38,23.55 74.77,28.16 65.13,28.16 64.41,28.89 64.41,35.65 63.67,36.39 C8.1 | 87.36,26.62 88.64,26.62 88.64,26.61 R3.1
N$22  (via drill 0.3 pad 0.61)
  other vias: 7.62,39.37
N$23  (via drill 0.3 pad 0.61)
  other vias: 13.59,44.2
N$25  (via drill 0.3 pad 0.61)
  other vias: 17.14,39.37
N$28  (via drill 0.3 pad 0.61)
  other vias: 12.7,13.97
N$35  (via drill 0.3 pad 0.61)
  other vias: 98.42,1.27
N$37  (via drill 0.3 pad 0.61)  (25 unrouted)
  other vias: 16.51,55.88 14.99,53.34 21.59,55.88 18.8,53.34 79.5,56.9 87.38,49.53 82.8,56.9 16,49.28 86.11,56.9 10.41,43.43 88.9,56.9 84.58,46.99 91.95,56.9 69.85,1.52 21.08,2.79 17.27,3.05 13.97,3.05 11.94,28.19 55.37,33.53 13.21,46.74 88.65,43.18 81.53,41.91 73.66,32 59.44,20.07 51.31,15.24 86.87,8.89
N$38  (via drill 0.3 pad 0.61)
  other vias: 12.7,10.16
N$39  (via drill 0.3 pad 0.61)
  other vias: 88.14,46.74
N$40  (via drill 0.3 pad 0.61)
  other vias: 98.42,16.51
N$41  (via drill 0.3 pad 0.61)
  other vias: 95.25,16.51
N$42  (via drill 0.3 pad 0.61)
  other vias: 98.42,19.68
N$43  (via drill 0.3 pad 0.61)
  other vias: 95.25,19.68
N$44  (via drill 0.3 pad 0.61)
  other vias: 97.79,41.91
N$45
  Bottom 0.457: F1.P$2 89.92,7.11 92.23,4.8 X4.1
N$47
  Bottom 0.305: IC1.6 79.38,17.88 80.02,17.88 82.84,15.05 Q1.1
N$48
  Bottom 0.305: IC1.2 80.64,9.86 ZD1.6 83.29,8.13 84.6,9.44 Q1.3
N$52
  Bottom 0.305: Q1.2 86.35,15.05 86.35,15.26 87.09,16 R4.1
NRESET
  Bottom 0.305: CTX-DB.10 19.27,32.72 20.06,33.52 20.06,36.02 19.46,36.63 18.26,36.63 U$1.34
RO-A  (via drill 0.3 pad 0.61)
  Top 0.305: U$2.D8 95.89,24.4 92.58,24.4 v88.95,28.03
  Bottom 0.305: RS485.1 88,28.98 v88.95,28.03
RST
  Bottom 0.305: IC2.3 40.17,50.16 40.66,49.68 40.66,29.68 41.85,28.49 U$1.17
RX1  (via drill 0.3 pad 0.61)
  Top 0.305: U$1.22 46.93,36.63 46.97,36.67 65.18,36.67 68.58,40.07 v68.58,40.34
  Bottom 0.305: UART1.3 46.75,13.73 46.75,17.2 45.85,18.11 45.85,31.92 46.93,33 U$1.22 | HMMOD-UART.5 71.01,50.23 71.01,44.08 70.12,43.18 69.6,43.18 68.58,42.16 v68.58,40.34
RX-MAPLE
  Top 0.305: U$2.RX1 73.03,24.4 70.48,24.4 U$2.TX0 70.28,22.59 55.56,22.59 53.34,24.8 53.34,25.27 52.15,26.47 33.14,26.47 26.61,33 U$1.30
  Bottom 0.305: UART0.3 36.27,11.43 36.27,13.65 32.9,17.02 32.9,26.71 26.61,33 U$1.30
RX_DBG  (via drill 0.3 pad 0.61)
  Top 0.305: v51.69,22.12 36.64,22.12 35.92,21.4 34.23,21.4 U$1.14 | U$3.TX 59.06,34.3 v53.51,28.75
  Bottom 0.305: 53.15,22.12 v51.69,22.12 | 53.15,22.12 53.15,28.39 v53.51,28.75 | 53.15,22.12 53.15,19.95 61.67,11.43 DBG.3 | TX.1 51.94,41.44 55.81,41.44 U$3.TX
SCK1  (via drill 0.3 pad 0.61)
  Top 0.305: 69.85,12.51 v49.11,12.51 | 69.85,12.51 72.82,12.51 73.66,13.35 CC1.SCLK | 69.85,12.51 69.85,12.5 CC_X1.4 | 75.14,49.49 76.91,47.72 76.91,41.38 75.93,40.4 73.35,40.4 71.75,38.8 71.75,37.27 70.16,35.67 55.39,35.67 v47.78,28.06 36.63,28.06 31.69,33 U$1.28 | 75.14,49.49 CC4.SCLK | 75.14,49.49 74.88,49.23 71.22,49.23 70.92,49.53 CC_X3.4 | CC2.SCLK 26.67,46.24 27.41,46.99 CC_X2.4 | CC_X0.4 30.68,6.35 30.68,7.1 29.21,8.57 27.1,8.57 26.67,8.14 CC0.SCLK
  Bottom 0.305: 48.04,12.74 45.66,10.36 43.65,10.36 42.32,9.03 42.32,8.56 36.49,2.73 33.86,2.73 33.02,3.57 33.02,4.12 31.86,5.28 31.75,5.28 CC_X0.4 | v47.78,28.06 47.78,24.03 48.04,23.77 48.04,12.74 | 48.04,12.74 48.88,12.74 v49.11,12.51 | CC_X2.4 31.75,45.92 31.64,45.92 30.65,44.94 30.65,37.66 31.69,36.63 U$1.28
SCK2
  Bottom 0.305: U$1.19 46.93,31.49 48.03,32.6 48.03,37.94 49.6,39.51 49.6,43.73 39.56,53.77 37.17,53.77 36.55,53.14 36.55,47.62 IC2.4
SCK-A
  Top 0.305: U$2.D13 90.81,36.42 85.08,30.69 65.56,30.69 64.37,29.5 64.37,29.28 63.31,28.22 62.4,28.22 61.98,28.63 55.67,28.63 NRF24L01+.5
SWCLK/TCK  (via drill 0.3 pad 0.61)
  Top 0.305: v26,22.59 24.82,21.4 24.07,21.4 U$1.10
  Bottom 0.305: v26,22.59 26,26.78 23.08,29.71 CTX-DB.4
SWDIO/TMS
  Bottom 0.305: U$1.11 26.61,21.4 26.62,21.42 26.62,27.44 24.35,29.71 CTX-DB.2
SWO/TDO
  Bottom 0.305: CTX-DB.6 21.81,29.71 21.65,29.71 18.58,26.64 18.58,21.81 18.99,21.4 U$1.8
TDI
  Bottom 0.305: U$1.9 21.53,17.75 18.54,17.75 17.88,18.41 17.88,26.95 20.54,29.61 CTX-DB.8
TX1  (via drill 0.3 pad 0.61)
  Top 0.305: v65.81,45.26 59.7,39.15 48.64,39.15 v47.95,39.85
  Bottom 0.305: v47.95,39.85 44.73,36.63 44.39,36.63 U$1.23 44.39,33 43.3,31.91 43.3,18.33 44.05,17.58 45.66,17.58 46.28,16.96 46.28,13.97 UART1.2 | HMMOD-UART.6 71.01,52.23 71.01,51.71 70.29,50.99 67.22,50.99 65.81,49.57 v65.81,45.26
TX-MAPLE
  Bottom 0.305: UART0.2 35.33,16.74 35.33,20.74 35,21.07 35,25.85 27.88,32.98 27.88,35.84 27.09,36.63 24.07,36.63 U$1.31
TX_DBG
  Top 0.305: U$1.15 36.77,17.75 57.9,17.75 61.67,13.97 DBG.2
  Bottom 0.305: RX.1 51.05,45.72 51.05,41.59 61.88,30.77 62.79,30.77 63.91,29.64 63.91,28.73 65,27.64 65.48,27.64 U$3.RX 65.48,25.73 65.33,25.57 65.33,13.97 DBG.2
VCC  (via drill 0.3 pad 0.61)
  Top 0.457: C7.2 69.42,19.94 70.33,19.03 v70.65,19.03 70.92,19.03 71.26,19.36 C2.2 73.52,19.36 73.54,19.35 73.58,19.35 CC1.VCC | 61.92,30.16 v61.92,30.15 | 61.92,30.16 62.2,30.44 63.1,30.44 63.98,31.32 63.98,31.8 65.36,33.18 74.95,33.18 78.11,36.34 U$2.VCC | 61.92,30.16 61.46,30.16 C12.1 | DBG.1 66.04,13.97 CC_X1.1 CC_X1.2 | IC2.10 58.3,50.16 57.38,49.25 47.24,49.25 44.99,51.5 | 44.99,51.5 CHPD.1 | 43.64,50.16 44.99,51.5 | 43.64,50.16 43.59,50.16 43.49,50.16 42.56,50.16 42.56,49.38 39.53,46.35 37.27,46.35 35.43,44.52 35.43,44.45 CC_X2.1 | ESP8266.VCC 43.64,50.16 | UART1.1 UART0.1 36.2,16.51 36.2,14.26 34.64,12.7 29.21,12.7 C10.+ | CC0.VCC 26.75,2.15 26.81,2.21 26.81,2.31 C1.2 29.1,2.31 30.61,3.81 CC_X0.2 CC_X0.1 | CC_X2.1 34.29,43.31 34.3,43.3 C5.+ 34.3,39.39 28.11,39.39 27.94,39.56 C3.2 26.81,40.59 26.75,40.53 26.75,40.24 CC2.VCC 24.05,40.24 24.05,40.02 21.9,37.87 | U$1.40 1.21,32.92 4.25,32.92 5.02,33.69 5.02,35.97 6.92,37.87 21.9,37.87 | CC4.VCC 73.84,55.53 73.54,55.83 C4.2 71.26,55.83 71.26,54.62 69.85,53.21 CC_X3.2 CC_X3.1 66.17,52.07 65.53,52.7 IC2.11 | CC_X2.2 CC_X2.1 | v22.67,29.13 22.67,37.1 21.9,37.87
  Bottom 0.457: 70.42,13.97 70.65,14.2 v70.65,19.03 | 70.42,13.97 70.99,13.97 70.99,13.64 71.93,12.7 3V3.1 | CC_X1.2 70.42,13.97 | 61.29,25.04 U$3.VCC 61.83,27.8 61.83,30.06 v61.92,30.15 | NRF24L01+.2 61.29,25.04 | 61.29,25.04 61.29,16.81 61.59,16.51 DBG.1 | U$2.VCC 78.11,39.72 76.83,39.72 74.31,42.23 | HMMOD-UART.1 74.31,42.23 | CC_X3.2 71.05,53.27 73.72,53.27 74.31,52.68 74.31,42.23 | C10.+ 25.31,15.33 25.31,22.77 24.35,23.73 CTX-DB.1 24.35,27.46 v22.67,29.13 | U$1.40 1.21,36.7 1.59,37.09 C6.1 | UART1.1 42.55,16.51 41.16,15.13 41.16,8.22 36.75,3.81 CC_X0.1 | IC2.10 58.3,50.16 58.3,52.7 IC2.11 62.08,52.7 62.08,52.87 C11.2
VDD  (via drill 0.3 pad 0.61)
  Top 0.457: v84.98,16.5 81.28,12.8 v81.28,10.87 77.94,7.53 X7.1
  Bottom 0.457: 85.95,17.47 v84.98,16.5 | 85.95,17.47 89.61,17.47 | R2.1 85.95,17.47 | C9.2 95.25,29.54 94.69,28.98 93,28.98 | 93,28.98 93,24.95 91.86,23.81 91.86,19.88 90.98,19 R1.1 89.95,17.81 89.61,17.47 | RS485.8 93,28.98 | 89.61,17.47 89.95,17.13 R4.2 89.95,14.26 89.92,14.22 F1.P$1 | IC1.1 81.92,11.66 81.28,11.02 v81.28,10.87 | X7.1 77.94,5.86 74.91,8.89 | 74.91,8.89 74.42,9.37 3V3.2 | 5V.1 74.91,8.89
WIZ_CS  (via drill 0.3 pad 0.61)
  Top 0.305: U$1.20 49.47,21.4 41.32,21.4 v41.23,21.49
  Bottom 0.305: IC2.5 40.17,45.09 40.17,40.09 38.2,38.12 38.2,30.64 41.23,27.62 v41.23,21.49
WIZ_RST  (via drill 0.3 pad 0.61)
  Top 0.305: v35.73,37.63 36.37,37.63 40.92,42.19 40.92,43.07 42.94,45.09 IC2.8
  Bottom 0.305: U$1.16 39.31,28.19 35.66,31.84 35.66,37.57 v35.73,37.63

### Text on the board
tNames: GND | CS | CC3 | ESP-03 | VCC | MOSI | SCK | LAN | MISO | IN | VCC | CS | GND | VCC | GND | 5V | MAPLE CUN - large (A) | Version 1.3 www.neuby.de | 31 (PB12) | + | + | TX | TX | RX | RX | GND | GND | VCC
bNames: ESP->MAPLE | RS485 | 1Wire | MAPLE CUN Lage Version A 1.3 | VDD | GND | VDD | GND